# EAGLE design stopduino (EAGLE 5.11)
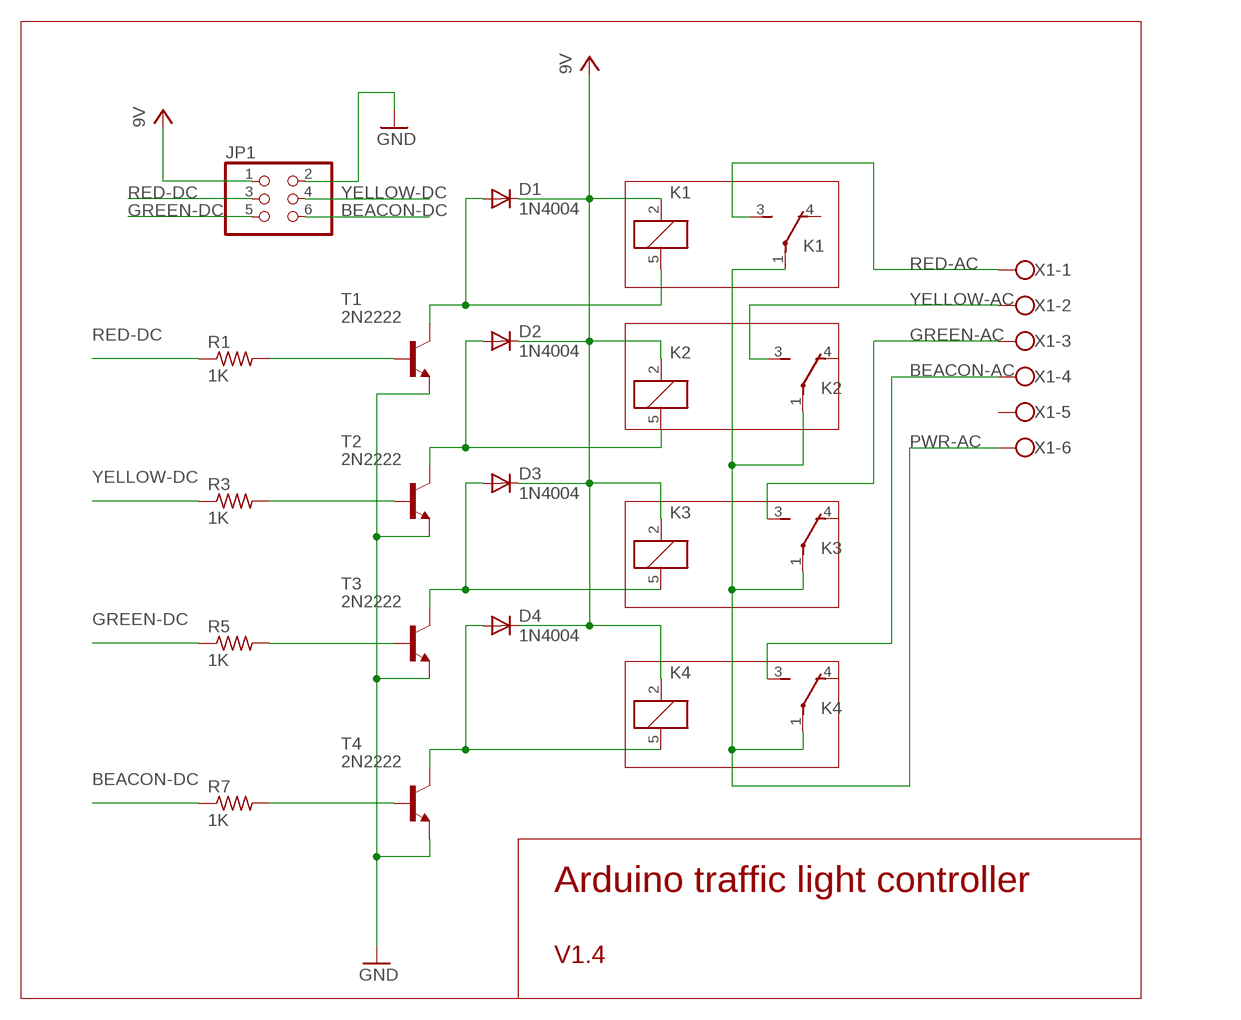
[diagram p0: schematic, sheet 1]

## Parts
D1  1N4004  [DO41-10]
D2  1N4004  [DO41-10]
D3  1N4004  [DO41-10]
D4  1N4004  [DO41-10]
JP1  PINHD-2X3  [2X03]
K1  AZ8-FORM-C  [AZ8]
K2  AZ8-FORM-C  [AZ8]
K3  AZ8-FORM-C  [AZ8]
K4  AZ8-FORM-C  [AZ8]
R1  1K  R-US_0207/10  [0207/10]
R3  1K  R-US_0207/10  [0207/10]
R5  1K  R-US_0207/10  [0207/10]
R7  1K  R-US_0207/10  [0207/10]
T1  2N2222  [TO92-EBC-OVAL]
T2  2N2222  [TO92-EBC-OVAL]
T3  2N2222  [TO92-EBC-OVAL]
T4  2N2222  [TO92-EBC-OVAL]
X1  W237-6  [W237-6]

## Nets
BEACON-AC [power]: K4.3(-1:S) X1.4
BEACON-DC: JP1.6 R7.1
GND: JP1.2 T1.E T2.E T3.E T4.E
GREEN-AC [power]: K3.3(-1:S) X1.3
GREEN-DC: JP1.5 R5.1
N$1: D4.A K4.5 T4.C
N$2: D3.A K3.5 T3.C
N$3: D2.A K2.5 T2.C
N$4: D1.A K1.5 T1.C
N$5: R5.2 T3.B
N$6: R1.2 T1.B
N$7: R3.2 T2.B
N$8: R7.2 T4.B
PWR-AC [power]: K1.1(-1:P) K2.1(-1:P) K3.1(-1:P) K4.1(-1:P) X1.6
RED-AC [power]: K1.3(-1:S) X1.1
RED-DC: JP1.3 R1.1
VCC: D1.C D2.C D3.C D4.C JP1.1 K1.2 K2.2 K3.2 K4.2 ; supply symbol labelled 9V
YELLOW-AC [power]: K2.3(-1:S) X1.2
YELLOW-DC: JP1.4 R3.1
Unconnected: K1.4(-1:O) K2.4(-1:O) K3.4(-1:O) K4.4(-1:O) X1.5

## Notes on the sheet
- Arduino traffic light controller
- V1.4

## Library data of the parts
D1-D4 = adafruit:1N4004: DIODE General purpose 1N400x type rectifier (With bigger pads) http://www.ladyada.net/library/pcb/eaglelibrary.html
JP1 = pinhead:PINHD-2X3: PIN HEADER
K1-K4 = relay:AZ8-FORM-C: MINIATURE PC BOARD RELAY Form C Source: www.azettler.com .. AZ8-1ch-12DSE.PDF; OC_FARNELL: unknown; OC_NEWARK: unknown
R1 R3 R5 R7 = adafruit:R-US_: RESISTOR, American symbol
T1-T4 = adafruit:2N2222: NPN TRANSISTOR Big oval pads
X1 = con-wago-500:W237-6: WAGO SCREW CLAMP; OC_FARNELL: unknown; OC_NEWARK: unknown

## Net classes
1 power: width 3 mm, clearance 0.9 mm

## Board
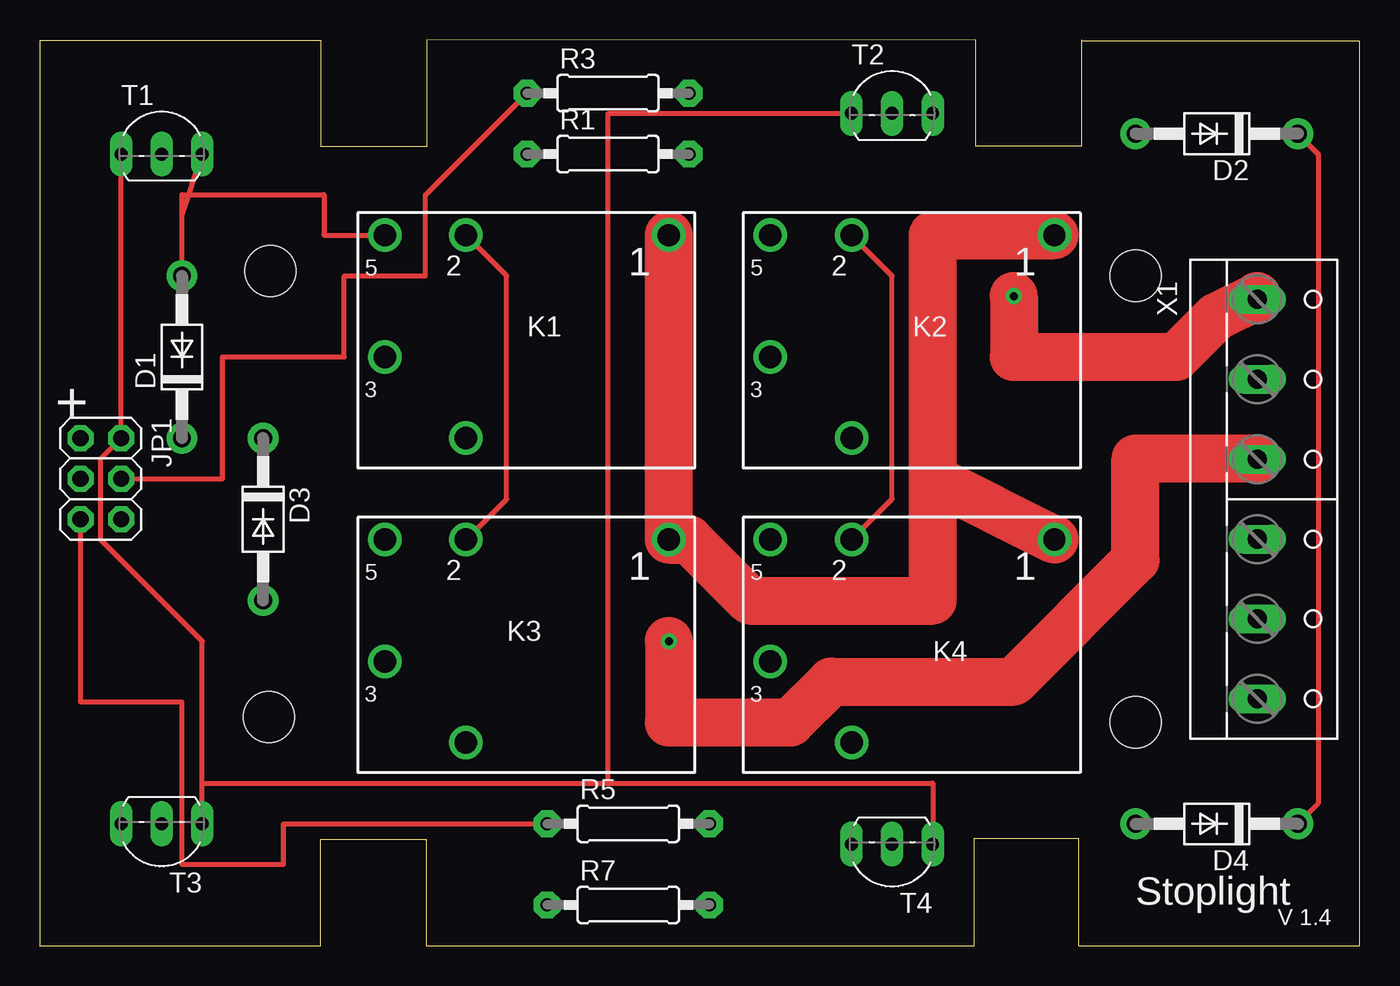
[diagram p1: board, top side]
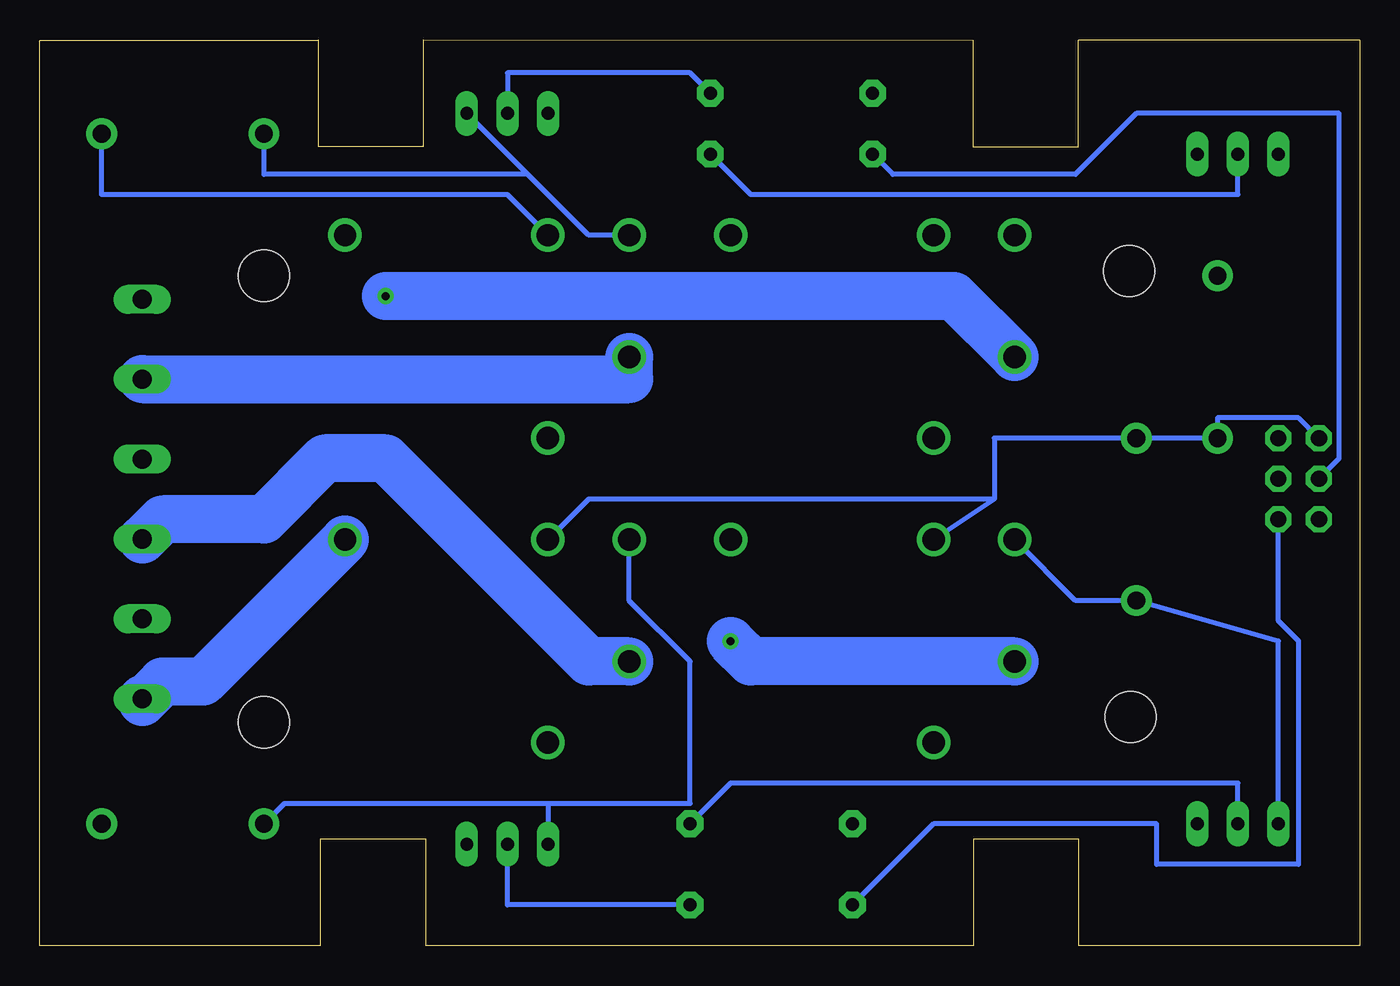
[diagram p2: board, bottom side, seen from below]

Size 82.6 x 56.67 mm. Coordinates in mm from the lower left corner, seen from the top.
Outline: 82.6,56.61 82.6,0 65.02,0 65.02,6.68 58.45,6.68 58.45,0 24.18,0 24.18,6.66 17.58,6.66 17.58,0 0,0 0,56.64 17.6,56.64 17.6,49.99 24.21,49.99 24.21,56.64 58.57,56.67 58.57,50.01 65.18,50.01 65.18,56.62
Outline: 65.18,56.67 65.18,56.62
Outline: 65.18,56.62 82.6,56.62
Copper layers (1*16): Top 0.035mm / dielectric 1.5mm / Bottom 0.035mm
Design rules "SparkFun *": minimum track width 12mil, minimum drill 20mil, track to track 12mil, track to pad 8mil, pad to pad 8mil, via to via 8mil, smd to smd 8mil, copper to edge 10mil, drill to drill 8mil, minimum pad ring 12mil, minimum via ring 10mil, stop-mask expansion 4mil, vias tented up to drill 25mil, thermal gap 10mil
Holes 3.2 mm at 14.33,14.3 68.58,13.97 68.58,41.91 14.43,42.21

### Footprints (pad centres in the part's own frame; a part is rotated, then mirrored left to right if it is on the bottom)
DO41-10 = drill 1.118 pad 1.93 round: A 5.08,0; C -5.08,0
2X03 = drill 1.016 octagon: 1 -2.54,-1.27; 2 -2.54,1.27; 3 0,-1.27; 4 0,1.27; 5 2.54,-1.27; 6 2.54,1.27
AZ8 = drill 1.4 pad 2 round: 1 8.89,6.35; 2 -3.81,6.35; 3 -8.89,-1.27; 4 -3.81,-6.35; 5 -8.89,6.35
0207/10 = drill 0.813 pad 1.676 octagon: 1 -5.08,0; 2 5.08,0
TO92-EBC-OVAL = drill 0.813 long: B 0,-1.27; C 2.54,-1.27; E -2.54,-1.27
W237-6 = drill 1.194 long: 1 -12.5,-1.27; 2 -7.5,-1.27; 3 -2.5,-1.27; 4 2.5,-1.27; 5 7.5,-1.27; 6 12.5,-1.27

### Placement (x,y rotation side)
D1  8.89,36.83 90 top
D2  73.66,50.8 180 top
D3  13.97,26.67 270 top
D4  73.66,7.62 180 top
JP1  3.81,29.21 270 top
K1  30.48,38.1 0 top
K2  54.61,38.1 0 top
K3  30.48,19.05 0 top
K4  54.61,19.05 0 top
R1  35.56,49.53 0 top
R3  35.56,53.34 0 top
R5  36.83,7.62 0 top
R7  36.83,2.54 0 top
T1  7.62,50.8 0 top
T2  53.34,53.34 0 top
T3  7.62,6.35 180 top
T4  53.34,5.08 180 top
X1  77.47,27.94 270 top

### Tracks (layer width: path | path; a pad name or v marks a point on that pad's centre or on a via)
BEACON-AC
  Bottom 3: K4.3 48.26,17.78 60.96,30.48 64.77,30.48 68.58,26.67 74.93,26.67 76.2,25.4 X1.4
BEACON-DC
  Bottom 0.305: JP1.6 5.08,20.32 3.81,19.05 3.81,5.08 12.7,5.08 12.7,7.62 26.67,7.62 R7.1
GND
  Top 0.305: T1.E JP1.2 3.81,30.48 3.81,25.4 10.16,19.05 10.16,10.16 | T4.E 55.88,10.16 35.56,10.16 | 10.16,10.16 35.56,10.16 | T3.E 10.16,10.16 | T2.E 35.56,52.07 35.56,10.16
GREEN-AC  (via drill 0.51)
  Top 3: v39.37,19.05 39.37,13.97 46.99,13.97 49.53,16.51 60.96,16.51 68.58,24.13 68.58,30.48 76.2,30.48 X1.3
  Bottom 3: v39.37,19.05 38.1,17.78 K3.3
GREEN-DC
  Top 0.305: JP1.5 2.54,15.24 8.89,15.24 8.89,5.08 15.24,5.08 15.24,7.62 R5.1
N$1
  Bottom 0.305: 50.8,8.89 T4.C | 50.8,8.89 67.31,8.89 D4.A | K4.5 45.72,21.59 41.91,17.78 41.91,8.89 50.8,8.89
N$2
  Bottom 0.305: T3.C 5.08,19.05 D3.A 17.78,21.59 K3.5
N$3
  Bottom 0.305: 52.07,48.26 48.26,44.45 K2.5 | 52.07,48.26 T2.C | D2.A 68.58,48.26 52.07,48.26
N$4
  Top 0.305: D1.A 8.89,45.72 T1.C | 8.89,44.45 8.89,46.99 17.78,46.99 17.78,44.45 K1.5
N$5
  Bottom 0.305: T3.B 7.62,10.16 39.37,10.16 R5.2
N$6
  Bottom 0.305: T1.B 7.62,46.99 38.1,46.99 R1.2
N$7
  Bottom 0.305: T2.B 53.34,54.61 41.91,54.61 R3.2
N$8
  Bottom 0.305: T4.B 53.34,2.54 R7.2
PWR-AC
  Top 3: K1.1 K3.1 40.64,25.4 44.45,21.59 55.88,21.59 55.88,29.21 | K2.1 55.88,44.45 55.88,29.21 | 55.88,29.21 K4.1
  Bottom 3: K4.1 72.39,16.51 74.93,16.51 76.2,15.24 X1.6
RED-AC  (via drill 0.51)
  Top 3: v60.96,40.64 60.96,36.83 71.12,36.83 73.66,39.37 76.2,40.64 X1.1
  Bottom 3: v60.96,40.64 25.4,40.64 K1.3
RED-DC
  Bottom 0.305: JP1.3 1.27,30.48 1.27,52.07 13.97,52.07 17.78,48.26 29.21,48.26 R1.1
VCC
  Top 0.305: D4.C 80.01,8.89 80.01,49.53 D2.C | K1.2 29.21,41.91 29.21,27.94 K3.2 | K2.2 53.34,41.91 53.34,27.94 K4.2
  Bottom 0.305: JP1.1 3.81,33.02 8.89,33.02 D1.C D3.C 22.86,31.75 22.86,27.94 | 22.86,27.94 K3.2 | K4.2 48.26,27.94 22.86,27.94 | D2.C 78.74,46.99 53.34,46.99 K2.2
YELLOW-AC
  Bottom 3: X1.2 45.72,35.44 K2.3
YELLOW-DC
  Top 0.305: JP1.4 11.43,29.21 11.43,36.83 19.05,36.83 19.05,41.91 24.13,41.91 24.13,46.99 R3.1

### Text on the board
tNames: 5 | 2 | 1 | 5 | 2 | 1 | 3 | 3 | + | 5 | 2 | 1 | 5 | 2 | 1 | 3 | 3 | Stoplight | V 1.4